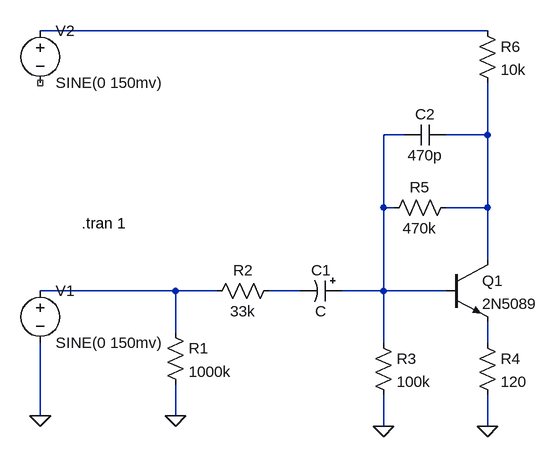
[diagram p0: schematic custom-muff.asc]
custom-muff.asc, the LTspice schematic file:
Version 4
SHEET 1 900 680
WIRE 528 -32 -160 -32
WIRE 400 128 368 128
WIRE 528 128 528 48
WIRE 528 128 464 128
WIRE 368 240 368 128
WIRE 384 240 368 240
WIRE 528 240 528 128
WIRE 528 240 464 240
WIRE 528 320 528 240
WIRE 48 368 -160 368
WIRE 112 368 48 368
WIRE 240 368 192 368
WIRE 368 368 368 240
WIRE 368 368 304 368
WIRE 464 368 368 368
WIRE 48 432 48 368
WIRE 368 448 368 368
WIRE 528 448 528 416
WIRE -160 560 -160 448
WIRE 48 560 48 512
WIRE 368 576 368 528
WIRE 528 576 528 528
FLAG 48 560 0
FLAG 368 576 0
FLAG 528 576 0
FLAG -160 560 0
SYMBOL res 32 416 R0
SYMATTR InstName R1
SYMATTR Value 1000k
SYMBOL res 208 352 R90
WINDOW 0 0 56 VBottom 2
WINDOW 3 32 56 VTop 2
SYMATTR InstName R2
SYMATTR Value 33k
SYMBOL res 352 432 R0
SYMATTR InstName R3
SYMATTR Value 100k
SYMBOL res 512 432 R0
SYMATTR InstName R4
SYMATTR Value 120
SYMBOL res 480 224 R90
WINDOW 0 0 56 VBottom 2
WINDOW 3 32 56 VTop 2
SYMATTR InstName R5
SYMATTR Value 470k
SYMBOL cap 464 112 R90
WINDOW 0 0 32 VBottom 2
WINDOW 3 32 32 VTop 2
SYMATTR InstName C2
SYMATTR Value 470p
SYMBOL npn 464 320 R0
SYMATTR InstName Q1
SYMATTR Value 2N5089
SYMBOL voltage -160 352 R0
SYMATTR InstName V1
SYMATTR Value SINE(0 150mv)
SYMATTR Value2 AC 150mv
SYMBOL voltage -160 -48 R0
SYMATTR InstName V2
SYMATTR Value SINE(0 150mv)
SYMATTR Value2 AC 150mv
SYMBOL res 512 -48 R0
SYMATTR InstName R6
SYMATTR Value 10k
SYMBOL polcap 304 352 R90
WINDOW 0 0 32 VBottom 2
WINDOW 3 32 32 VTop 2
SYMATTR InstName C1
TEXT -96 264 Left 2 !.tran 1

The netlist it stands for:
* custom-muff.asc
R1 N004 0 1000k
R2 N005 N004 33k
R3 N002 0 100k
R4 N006 0 120
R5 N003 N002 470k
C2 N003 N002 470p
Q1 N003 N002 N006 0 2N5089
V1 N004 0 SINE(0 150mv) AC 150mv
V2 N001 NC_01 SINE(0 150mv) AC 150mv
R6 N001 N003 10k
C1 N002 N005 C
.model NPN NPN
.model PNP PNP
.lib standard.bjt
.tran 1
.backanno
.end